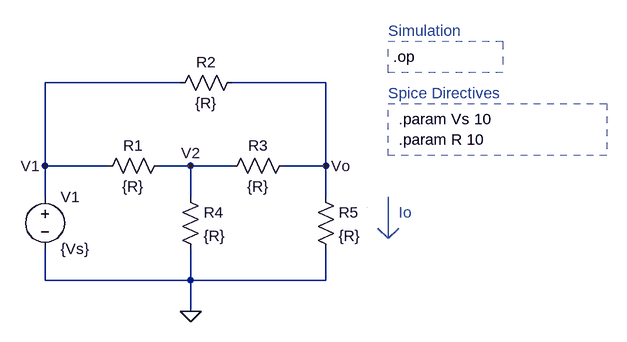
[diagram p0: schematic Example_1_op.asc]
Example_1_op.asc, the LTspice schematic file:
Version 4
SHEET 1 1432 696
WIRE 320 128 112 128
WIRE 544 128 400 128
WIRE 112 256 112 128
WIRE 208 256 112 256
WIRE 336 256 288 256
WIRE 400 256 336 256
WIRE 544 256 544 128
WIRE 544 256 480 256
WIRE 112 304 112 256
WIRE 336 304 336 256
WIRE 544 304 544 256
WIRE 112 432 112 384
WIRE 336 432 336 384
WIRE 336 432 112 432
WIRE 544 432 544 384
WIRE 544 432 336 432
WIRE 336 480 336 432
FLAG 336 480 0
FLAG 544 256 Vo
FLAG 112 256 V1
FLAG 336 256 V2
SYMBOL voltage 112 288 R0
SYMATTR InstName V1
SYMATTR Value {Vs}
SYMBOL res 304 240 R90
WINDOW 0 0 56 VBottom 2
WINDOW 3 32 56 VTop 2
SYMATTR InstName R1
SYMATTR Value {R}
SYMBOL res 416 112 R90
WINDOW 0 0 56 VBottom 2
WINDOW 3 32 56 VTop 2
SYMATTR InstName R2
SYMATTR Value {R}
SYMBOL res 496 240 R90
WINDOW 0 0 56 VBottom 2
WINDOW 3 32 56 VTop 2
SYMATTR InstName R3
SYMATTR Value {R}
SYMBOL res 320 288 R0
SYMATTR InstName R4
SYMATTR Value {R}
SYMBOL res 528 288 R0
SYMATTR InstName R5
SYMATTR Value {R}
TEXT 640 48 Left 2 ;Simulation
TEXT 648 88 Left 2 !.op
TEXT 656 184 Left 2 !.param Vs 10\n.param R 10
TEXT 640 144 Left 2 ;Spice Directives
TEXT 656 328 Left 2 ;Io
LINE Normal 608 320 608 320 2
LINE Normal 624 352 640 368
LINE Normal 656 352 640 368
LINE Normal 640 304 640 368
RECTANGLE Normal 816 112 640 64 2
RECTANGLE Normal 976 240 640 160 2

The netlist it stands for:
* Example_1_op.asc
V1 V1 0 {Vs}
R1 V2 V1 {R}
R2 Vo V1 {R}
R3 Vo V2 {R}
R4 V2 0 {R}
R5 Vo 0 {R}
* Simulation
.op
.param Vs 10
.param R 10
* Spice Directives
* Io
.backanno
.end